# Altium schematic sheet RX.SchDoc
size A4
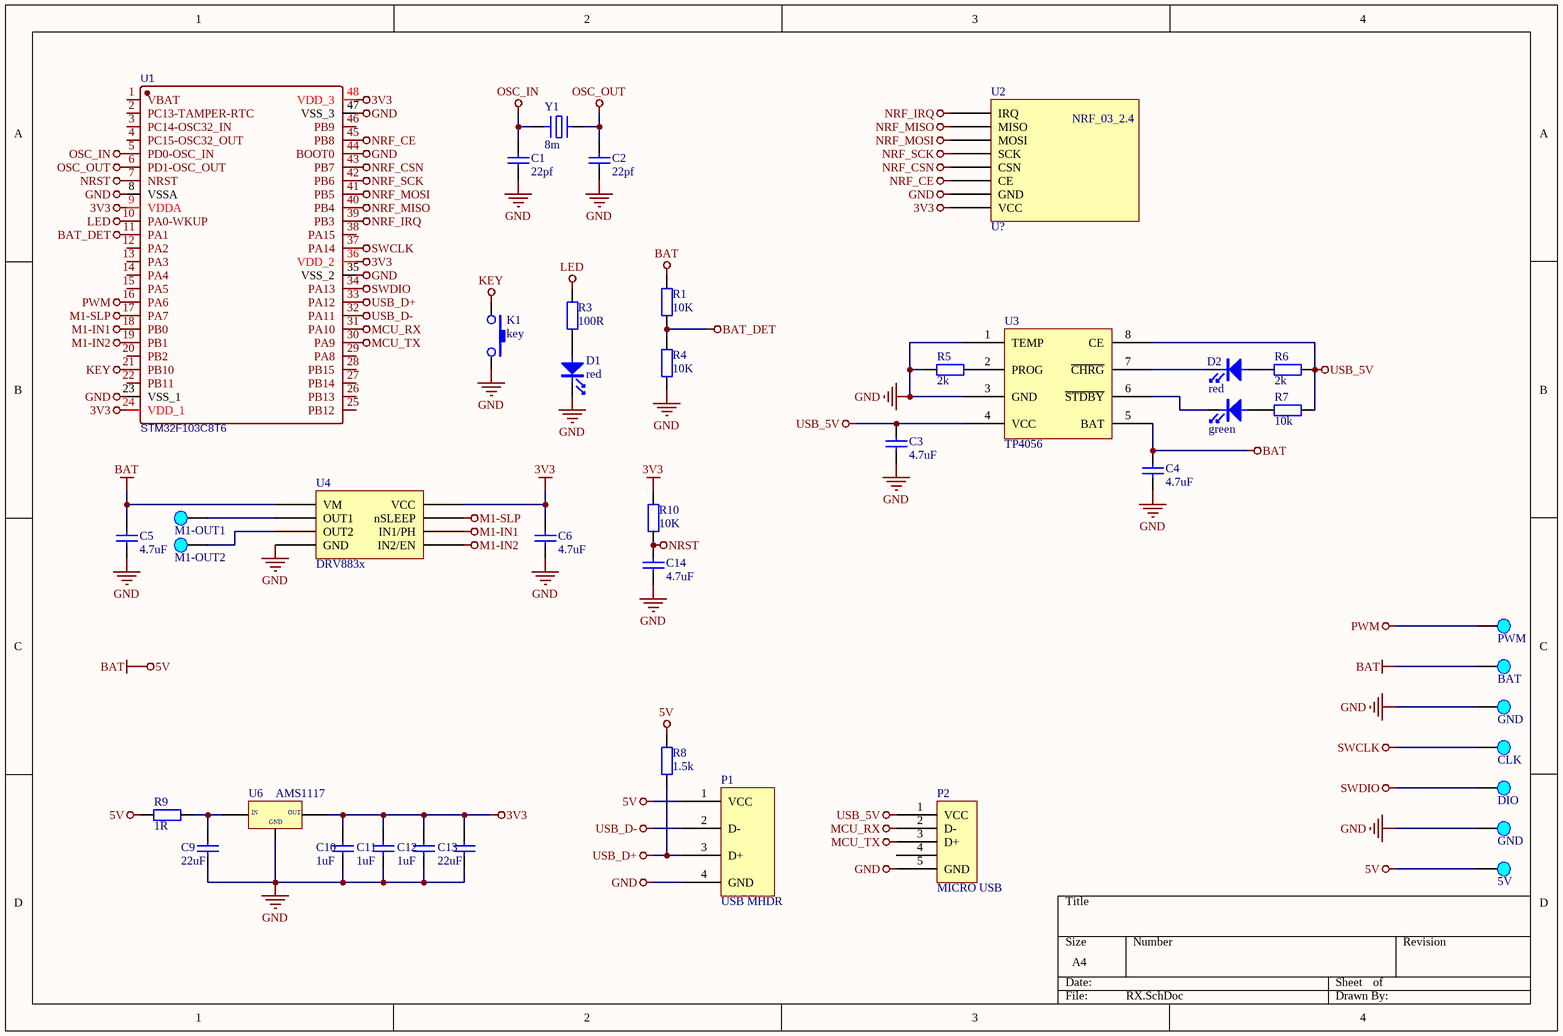
[diagram p0: RX.SchDoc]

## Parts
5V  5V  [Pad_B]
BAT  BAT  [Pad_B]
C1  22pf  [电容_C0603]
C2  22pf  [电容_C0603]
C3  4.7uF  [电容_C0603]
C4  4.7uF  [电容_C0603]
C5  4.7uF  [电容_C0603]
C6  4.7uF  [电容_C0603]
C9  22uF  [电容_C0603]
C10  1uF  [电容_C0603]
C11  1uF  [电容_C0603]
C12  1uF  [电容_C0603]
C13  22uF  [电容_C0603]
C14  4.7uF  [电容_C0603]
CLK  CLK  [Pad_B]
D1  red  [LED_0603]
D2  red  [LED_0603]
D3  green  [LED_0603]
DIO  DIO  [Pad_B]
GND  GND  [Pad_B]
GND1  GND  [Pad_B]
K1  key  [开关按键_SKTH]
M1  M1-OUT1  [Pad_B]
M2  M1-OUT2  [Pad_B]
P1  USB MHDR  [接插件_USB 公头 90°]
P2  MICRO USB  [接插件_MICRO 牛角插座 USB 卷边]
PWM  PWM  [Pad_B]
R1  10K  [电阻_R0603]
R3  100R  [电阻_R0603]
R4  10K  [电阻_R0603]
R5  2k  [电阻_R0603]
R6  2k  [电阻_R0603]
R7  R: 10k  [电阻_R0603]  (hidden comment: 2k)
R8  1.5k  [电阻_R0603]
R9  1R  [电阻_R0603]
R10  10K  [电阻_R0603]
U1  STM32F103C8T6  [STM32F103C8T6]
U2  U?  [NRF-1]
U3  TP4056  [SOP-8_PAD]
U4  DRV883x  [WSON-8]
U6  AMS1117  [稳压芯片_SOT-89]
Y1  F: 8m  [晶振_5032]  (hidden comment: XTAL)

## Nets
3V3: C6.2 C10.2 C11.2 C12.2 C13.2 R10.2 U1.9(VDDA) U1.24(VDD_1) U1.36(VDD_2) U1.48(VDD_3) U2.1(VCC) U4.8(VCC) U6.2(OUT)
5V: 5V.1 BAT.1 C4.2 C5.1 P1.1(VCC) R1.2 R8.2 R9.2 U3.5(BAT) U4.1(VM)  [also labelled BAT]
BAT_DET: R1.1 R4.2 U1.11(PA1)
GND: C1.1 C2.1 C3.1 C4.1 C5.2 C6.1 C9.1 C10.1 C11.1 C12.1 C13.1 C14.1 D1.K GND.1 GND1.1 K1.2 P1.0(GND) P1.4(GND) P2.0 P2.5(GND) R4.1 R5.1 U1.8(VSSA) U1.23(VSS_1) U1.35(VSS_2) U1.44(BOOT0) U1.47(VSS_3) U2.2(GND) U3.0(GND) U3.1(TEMP) U3.3(GND) U4.4(GND) U6.1(GND)
KEY: K1.1 U1.21(PB10)
LED: R3.2 U1.10(PA0-WKUP)
M1-IN1: U1.18(PB0) U4.6(IN1/PH)
M1-IN2: U1.19(PB1) U4.5(IN2/EN)
M1-SLP: U1.17(PA7) U4.7(nSLEEP)
MCU_RX: P2.2(D-) U1.31(PA10)
MCU_TX: P2.3(D+) U1.30(PA9)
NRF_CE: U1.45(PB8) U2.3(CE)
NRF_CSN: U1.43(PB7) U2.4(CSN)
NRF_IRQ: U1.39(PB3) U2.8(IRQ)
NRF_MISO: U1.40(PB4) U2.7(MISO)
NRF_MOSI: U1.41(PB5) U2.6(MOSI)
NRF_SCK: U1.42(PB6) U2.5(SCK)
NRST: C14.2 R10.1 U1.7(NRST)
OSC_IN: C1.2 U1.5(PD0-OSC_IN) Y1.1
OSC_OUT: C2.2 U1.6(PD1-OSC_OUT) Y1.2
PWM: PWM.1 U1.16(PA6)
SWCLK: CLK.1 U1.37(PA14)
SWDIO: DIO.1 U1.34(PA13)
USB_5V: C3.2 P2.1(VCC) R6.2 R7.2 U3.4(VCC) U3.8(CE)
USB_D+: P1.3(D+) R8.1 U1.33(PA12)
USB_D-: P1.2(D-) U1.32(PA11)
NetC9_2: C9.2 R9.1 U6.3(VIN)
NetD1_A: D1.A R3.1
NetD2_A: D2.A R6.1
NetD2_K: D2.K U3.7(~{CHRG})
NetD3_A: D3.A R7.1
NetD3_K: D3.K U3.6(~{STDBY})
NetM1_1: M1.1 U4.2(OUT1)
NetM2_1: M2.1 U4.3(OUT2)
NetR5_2: R5.2 U3.2(PROG)

Not connected (* = marked no-connect by the designer): P2 4; U1 1(VBAT) 2(PC13-TAMPER-RTC) 3(PC14-OSC32_IN) 4(PC15-OSC32_OUT) 12(PA2) 13(PA3) 14(PA4) 15(PA5) 20(PB2) 22(PB11) 25(PB12) 26(PB13) 27(PB14) 28(PB15) 29(PA8) 38(PA15) 46(PB9)

## Notes on the sheet
- (in symbol AMS1117) IN
- (in symbol NRF) NRF_03_2.4

## Library data of the parts
5V = Pad: _Funcyusa: Test; _Specification: Pad,Test,5V; _Comma: ,; _Name: Pad; _Remarks: 5V
BAT = Pad: _Funcyusa: Test; _Specification: Pad,Test,BAT; _Comma: ,; _Name: Pad; _Remarks: BAT
C1-C6 C9-C14 = cap: U: 50V; 参数: Cap,0805,X7R,104K,50V,125C,±10%
  C1 C2: C: 22pf
  C3-C6 C14: C: 4.7uF
  C9 C13: C: 22uF
  C10-C12: C: 1uF
CLK = Pad: _Funcyusa: Test; _Specification: Pad,Test,CLK; _Comma: ,; _Name: Pad; _Remarks: CLK
D1-D3 = LED: 参数: LED,0603,Red
DIO = Pad: _Funcyusa: Test; _Specification: Pad,Test,DIO; _Comma: ,; _Name: Pad; _Remarks: DIO
GND GND1 = Pad: _Funcyusa: Test; _Specification: Pad,Test,GND; _Comma: ,; _Name: Pad; _Remarks: GND
K1 = SW-PB_1: 参数: Key,TS-018A 2*4全包无柱带支架 力度250N; 备注: ADD
M1 = Pad: _Funcyusa: Test; _Specification: Pad,Test,M1-OUT1; _Comma: ,; _Name: Pad; _Remarks: M1-OUT1
M2 = Pad: _Funcyusa: Test; _Specification: Pad,Test,M1-OUT2; _Comma: ,; _Name: Pad; _Remarks: M1-OUT2
P2 = MICRO USB 5PIN: _Comma: ,; _Name: Port; _Specification: Port,MICRO USB,5PIN; _Value: 5PIN; _Model: MICRO USB
PWM = Pad: _Funcyusa: Test; _Specification: Pad,Test,PWM; _Comma: ,; _Name: Pad; _Remarks: PWM
R1 R3-R10 = Res: P: 1/8W; 参数: Res,0805,0R,±1%,1/8W,100ppm,155C
  R1 R4 R10: R: 10K
  R3: R: 100R
  R5 R6: R: 2k
  R8: R: 1.5k
  R9: R: 1R
U1 = STM32F103C8T6: BOM_Manufacturer: STMicroelectronics; SMT Type: Basic; timeStamp: 1455028086; BOM_Supplier: LCSC; BOM_Manufacturer Part: STM32F103C8T6; BOM_LCSC Assembly: Yes; image: //image.lceda.cn/szlcsc/C8734.jpg; BOM_Supplier Part: C8734; spicePre: U; spiceSymbolName: STM32F103C8T6
U2 = NRF: NRF24L01
U3 = TP4056: 参数: Charge Control,LP4056,ESOP-8